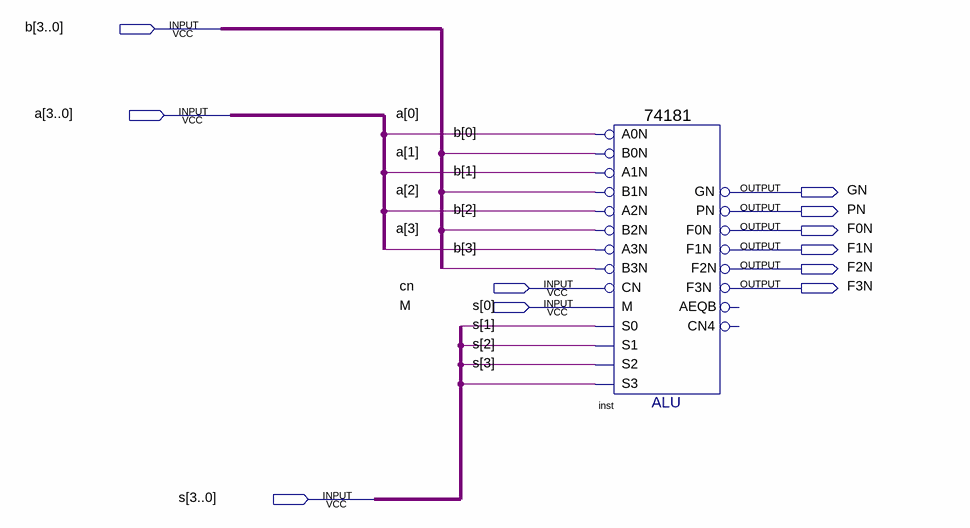
[diagram p0: schematic sheet]
// Quartus schematic weak_adder.bdf as structural Verilog: 1 symbols, 11 pins
module weak_adder (
  input  [3:0] b,
  input  [3:0] a,
  input  cn,
  input  M,
  input  [3:0] s,
  output GN,
  output PN,
  output F0N,
  output F1N,
  output F2N,
  output F3N
);

  \74181  inst (
    .B0N(b[0]), .A0N(a[0]), .A1N(a[1]), .B1N(b[1]), .A3N(a[3]), .B2N(b[2]), .A2N(a[2]), .M(M), .CN(cn),
    .B3N(b[3]), .S2(s[2]), .S1(s[1]), .S0(s[0]), .S3(s[3]), .PN(PN), .GN(GN), .F3N(F3N), .F1N(F1N),
    .F0N(F0N), .F2N(F2N));  // open: AEQB, CN4
endmodule
